# EAGLE schematic CBMINI (EAGLE 9.5.2)
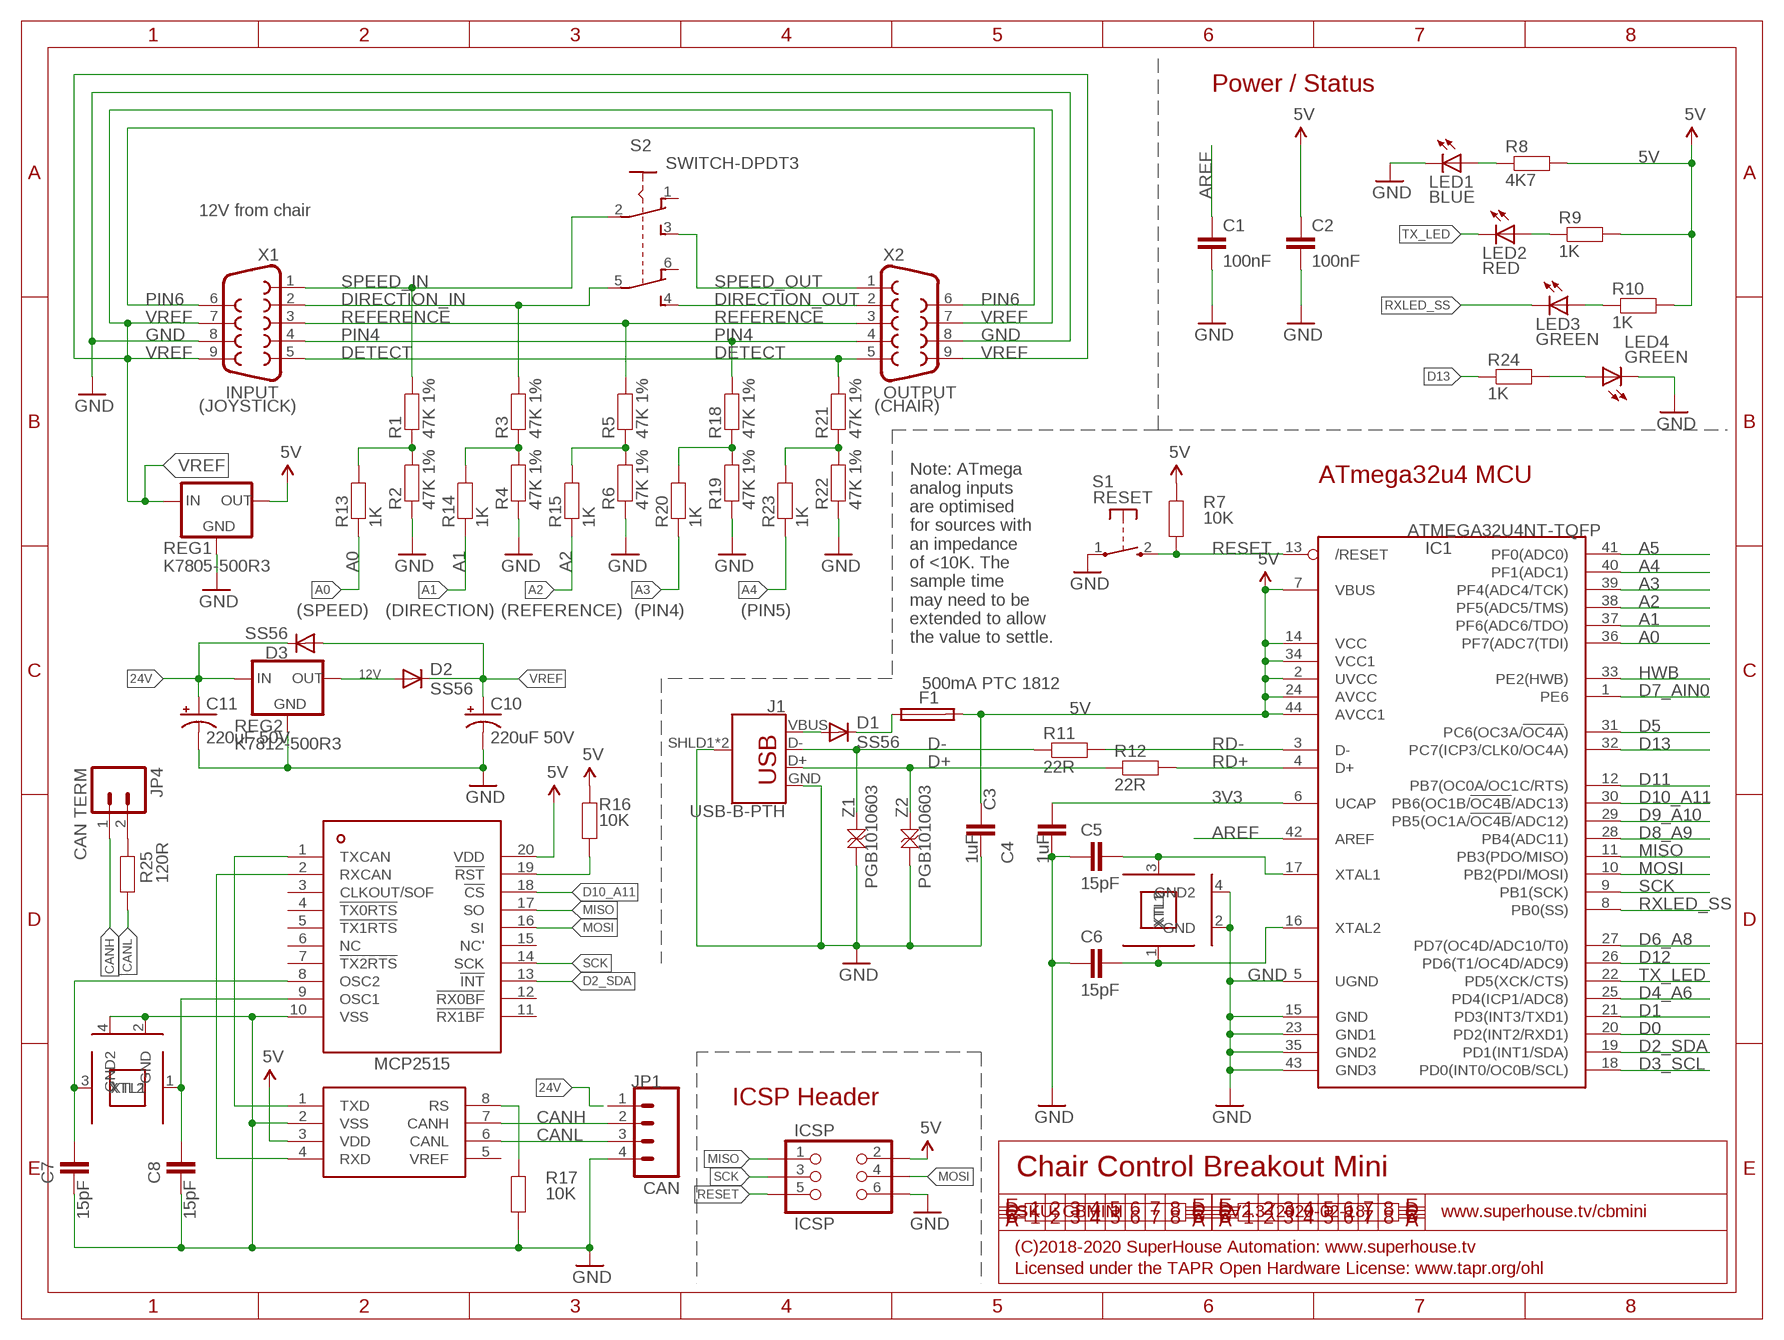
[diagram p0: schematic, sheet 1]

## Parts
C1  100nF  CAP0603  [C0603]
C2  100nF  CAP0603  [C0603]
C3  1uF  CAP0603  [C0603]
C4  1uF  CAP0603  [C0603]
C5  15pF  CAP0603  [C0603]
C6  15pF  CAP0603  [C0603]
C7  15pF  CAP0603  [C0603]
C8  15pF  CAP0603  [C0603]
C10  220uF 50V  CAP_POLG  [PANASONIC_G]
C11  220uF 50V  CAP_POLG  [PANASONIC_G]
D1  SS56  DIODESMA  [SMA-DIODE]
D2  SS56  DIODESMA  [SMA-DIODE]
D3  SS56  DIODESMA  [SMA-DIODE]
F1  500mA PTC 1812  PTC050  [1812]
IC1  ATMEGA32U4NT-TQFP  [TQFP44]
IC2  MCP2515  [TSSOP20]
IC3  MCP2551  [SO08]
ICSP  ICSP  ICSP-PIN  [2X03-ICSP]
J1  USB-B-PTH  [USB-B-PTH]
JP1  CAN  M04-PIN  [1X04-P]
JP4  CAN TERM  M02-PIN  [1X02-P]
LED1  BLUE  LED0603  [LED-0603]
LED2  RED  LED0603  [LED-0603]
LED3  GREEN  LED0603  [LED-0603]
LED4  GREEN  LED0603  [LED-0603]
R1  47K 1%  RESISTOR0603  [R0603]
R2  47K 1%  RESISTOR0603  [R0603]
R3  47K 1%  RESISTOR0603  [R0603]
R4  47K 1%  RESISTOR0603  [R0603]
R5  47K 1%  RESISTOR0603  [R0603]
R6  47K 1%  RESISTOR0603  [R0603]
R7  10K  RESISTOR0603  [R0603]
R8  4K7  RESISTOR0603  [R0603]
R9  1K  RESISTOR0603  [R0603]
R10  1K  RESISTOR0603  [R0603]
R11  22R  RESISTOR0603  [R0603]
R12  22R  RESISTOR0603  [R0603]
R13  1K  RESISTOR0603  [R0603]
R14  1K  RESISTOR0603  [R0603]
R15  1K  RESISTOR0603  [R0603]
R16  10K  RESISTOR0603  [R0603]
R17  10K  RESISTOR0603  [R0603]
R18  47K 1%  RESISTOR0603  [R0603]
R19  47K 1%  RESISTOR0603  [R0603]
R20  1K  RESISTOR0603  [R0603]
R21  47K 1%  RESISTOR0603  [R0603]
R22  47K 1%  RESISTOR0603  [R0603]
R23  1K  RESISTOR0603  [R0603]
R24  1K  RESISTOR0603  [R0603]
R25  120R  RESISTOR0603  [R0603]
REG1  K7805-500R3  K78XX-500R3  [K78XX-500R3]
REG2  K7812-500R3  K78XX-500R3  [K78XX-500R3]
S1  RESET  TAC_SWITCH_2PINSMT  [TACTILE_SMT_3X4X2]
S2  SWITCH-DPDT3  [7201SD9AV2BE]
X1  INPUT  DB9-PCB-PLUG  [DB9-PCB-PLUG]
X2  OUTPUT  DB9-PCB-SOCKET  [DB9-PCB-SOCKET]
XTL1  16MHz  CRYSTAL-GND3X2  [CRYSTAL-SMD-3X2]
XTL2  16MHz  CRYSTAL-GND3X2  [CRYSTAL-SMD-3X2]
Z1  PGB1010603  TVS0603  [TVS0603]
Z2  PGB1010603  TVS0603  [TVS0603]

## Nets
3V3: C4.2 IC1.6(UCAP)
5V: C2.1 C3.1 F1.2 IC1.2(UVCC) IC1.7(VBUS) IC1.14(VCC) IC1.24(AVCC) IC1.34(VCC1) IC1.44(AVCC1) IC2.20(VDD) IC3.3(VDD) ICSP.2 R7.2 R8.2 R9.2 R10.2 R16.2 REG1.3(OUT)
12V: D2.A REG2.3(OUT)
24V: C11.+ D3.C JP1.1 REG2.1(IN)
A0: IC1.36(PF7(ADC7(TDI)) R13.1
A1: IC1.37(PF6(ADC6/TDO)) R14.1
A2: IC1.38(PF5(ADC5/TMS)) R15.1
A3: IC1.39(PF4(ADC4/TCK)) R20.1
A4: IC1.40(PF1(ADC1)) R23.1
A5: IC1.41(PF0(ADC0))
AREF: C1.1 IC1.42(AREF)
CANH: IC3.7(CANH) JP1.2 JP4.1
CANL: IC3.6(CANL) JP1.3 R25.1
D0: IC1.20(PD2(INT2/RXD1))
D1: IC1.21(PD3(INT3/TXD1))
D2_SDA: IC1.19(PD1(INT1/SDA)) IC2.13(!INT)
D3_SCL: IC1.18(PD0(INT0/OC0B/SCL))
D4_A6: IC1.25(PD4(ICP1/ADC8))
D5: IC1.31(PC6(OC3A/!OC4A!))
D6_A8: IC1.27(PD7(OC4D/ADC10/T0))
D7_AIN0: IC1.1(PE6)
D8_A9: IC1.28(PB4(ADC11))
D9_A10: IC1.29(PB5(OC1A/!OC4B!/ADC12))
D10_A11: IC1.30(PB6(OC1B/!OC4B!/ADC13)) IC2.18(!CS)
D11: IC1.12(PB7(OC0A/OC1C/RTS))
D12: IC1.26(PD6(T1/OC4D/ADC9))
D13: IC1.32(PC7(ICP3/CLK0/OC4A)) R24.1
D+: J1.D+ R12.1 Z2.2
D-: J1.D- R11.1 Z1.2
DETECT: R21.2 X1.5 X2.5
DIRECTION_IN: R3.2 S2.5 X1.2
DIRECTION_OUT: S2.4 X2.2
GND: C1.2 C2.2 C3.2 C4.1 C5.1 C6.1 C7.1 C8.1 C10.- C11.- IC1.5(UGND) IC1.15(GND) IC1.23(GND1) IC1.35(GND2) IC1.43(GND3) IC2.10(VSS) IC3.2(VSS) ICSP.6 J1.GND J1.SHLD1(SHIELD) J1.SHLD2(SHIELD) JP1.4 LED1.C LED4.C R2.1 R4.1 R6.1 R17.1 R19.1 R22.1 REG1.2(GND) REG2.2(GND) S1.1(P) X1.8 X2.8 XTL1.2(GND) XTL1.4(GND2) XTL2.2(GND) XTL2.4(GND2) Z1.1 Z2.1
HWB: IC1.33(PE2(HWB))
MISO: IC1.11(PB3(PDO/MISO)) IC2.17(SO) ICSP.1
MOSI: IC1.10(PB2(PDI/MOSI)) IC2.16(SI) ICSP.4
N$1: LED4.A R24.2
N$2: R1.1 R2.2 R13.2
N$3: R3.1 R4.2 R14.2
N$4: R5.1 R6.2 R15.2
N$5: LED1.A R8.1
N$7: LED2.A R9.1
N$8: LED3.A R10.1
N$9: IC2.1(TXCAN) IC3.1(TXD)
N$10: IC2.19(!RST) R16.1
N$11: C5.2 IC1.17(XTAL1) XTL1.3(XTL2)
N$12: C6.2 IC1.16(XTAL2) XTL1.1(XTL1)
N$13: IC2.2(RXCAN) IC3.4(RXD)
N$14: C8.2 IC2.9(OSC1) XTL2.1(XTL1)
N$16: IC3.8(RS) R17.2
N$17: D1.C F1.1
N$18: C7.2 IC2.8(OSC2) XTL2.3(XTL2)
N$19: R18.1 R19.2 R20.2
N$20: JP4.2 R25.2
N$21: R21.1 R22.2 R23.2
PIN4: R18.2 X1.4 X2.4
PIN6: X1.6 X2.6
RD+: IC1.4(D+) R12.2
RD-: IC1.3(D-) R11.2
REFERENCE: R5.2 X1.3 X2.3
RESET: IC1.13(/RESET) ICSP.5 R7.1 S1.2(S)
RXLED_SS: IC1.8(PB0(SS)) LED3.C
SCK: IC1.9(PB1(SCK)) IC2.14(SCK) ICSP.3
SPEED_IN: R1.2 S2.2 X1.1
SPEED_OUT: S2.3 X2.1
TX_LED: IC1.22(PD5(XCK/CTS)) LED2.C
USB+: D1.A J1.VBUS
VREF: C10.+ D2.C D3.A REG1.1(IN) X1.7 X1.9 X2.7 X2.9
Unconnected: IC2.3(CLKOUT/SOF) IC2.4(!TX0RTS) IC2.5(!TX1RTS) IC2.6(NC) IC2.7(!TX2RTS) IC2.11(!RX1BF) IC2.12(!RX0BF) IC2.15(NC') IC3.5(VREF) S2.1 S2.6

## Notes on the sheet
- Power / Status
- 12V from chair
- (JOYSTICK) | (CHAIR)
- ATmega32u4 MCU
- (SPEED) | (DIRECTION) | (REFERENCE) | (PIN4) | (PIN5)
- Note: ATmega
  analog inputs
  are optimised
  for sources with
  an impedance
  of <10K. The
  sample time
  may need to be
  extended to allow
  the value to settle.
- ICSP Header
- Chair Control Breakout Mini
- SKU: CBMINI | V2.3 (2020-02-18) | www.superhouse.tv/cbmini
- (C)2018-2020 SuperHouse Automation: www.superhouse.tv
- Licensed under the TAPR Open Hardware License: www.tapr.org/ohl

## Library data of the parts
C1-C8 = SuperHouse-DiscreteSemi:CAP: Capacitor Standard ceramic capacitor
C10 C11 = SuperHouse-DiscreteSemi:CAP_POL: Capacitor Polarized These are standard SMD and PTH capacitors. Normally 10uF, 47uF, and 100uF in electrolytic and tantalum varieties. Always verify the external diameter of the through hole cap, it varies with capacity, voltage, and manufacturer. The EIA devices should be standard.
D1-D3 = SuperHouse-DiscreteSemi:DIODE: Diode Standard reverse protection diodes and small signal diodes. SMA package can handle up to about 1A. SOD-323 can handle about 200mA.
F1 = SuperHouse-Fuses:PTC: MF-SMDF Series - PRC Resettable Fuses Source: http://www.farnell.com/datasheets/716597.pdf
IC1 = SuperHouse-MCUs:ATMEGA32U4NT: ATmega32u4 MCU
IC2 = SuperHouse-ICs:MCP2515: Microchip Technology’s MCP2515 is a stand-alone Controller Area Network (CAN) controller that implements the CAN specification, version 2.0B. It is capable of transmitting and receiving both standard and extended data and remote frames. The MCP2515 has two acceptance masks and six acceptance filters that are used to filter out unwanted messages, thereby reducing the host MCUs overhead. The MCP2515 interfaces with microcontrollers (MCUs) via an industry standard Serial Peripheral Interface (SPI).
IC3 = SuperHouse-ICs:MCP2551: CAN bus transceiver. Pin compatible chips with different specs include: MCP2551 (5V only) TCAN332DR (3.3V)
ICSP = SuperHouse-Connectors:ICSP
J1 = SuperHouse-Connectors:USB-B: USB Type B Connector
JP1 = SuperHouse-Connectors:M04: 4-way header Standard 1x4 header, and screw terminal variations
JP4 = SuperHouse-Connectors:M02: 2-way header Standard 1x2 header, and screw terminal variations
LED1-LED4 = SuperHouse-LEDs:LED: LEDs Standard schematic elements and footprints for 5mm, 3mm, 1206, and 0603 sized LEDs. 5mm - Spark Fun Electronics SKU : COM-00529 (and others)
R1-R25 = SuperHouse-DiscreteSemi:RESISTOR: Resistor Standard resistors.
REG1 REG2 = SuperHouse-Regulators:K78XX-500R3: K78xx-500R3 switchmode voltage regulator
S1 = SuperHouse-Switches:TAC_SWITCH_2PIN: Momentary Tactile Switch - 2 pin Uxcell 3x4x2mm switch with 2 SMT pads
S2 = SuperHouse-Switches:SWITCH-DPDT: DPDT toggle switch
X1 = SuperHouse-Connectors:DB9: DB9 Connector; PROD_ID: CONN-09904
X2 = SuperHouse-Connectors:DB9: DB9 Connector
XTL1 XTL2 = SuperHouse-Oscillators:CRYSTAL-GND: 3x2mm SMT crystal
Z1 Z2 = SuperHouse-DiscreteSemi:TVS: TVS voltage protection Zener